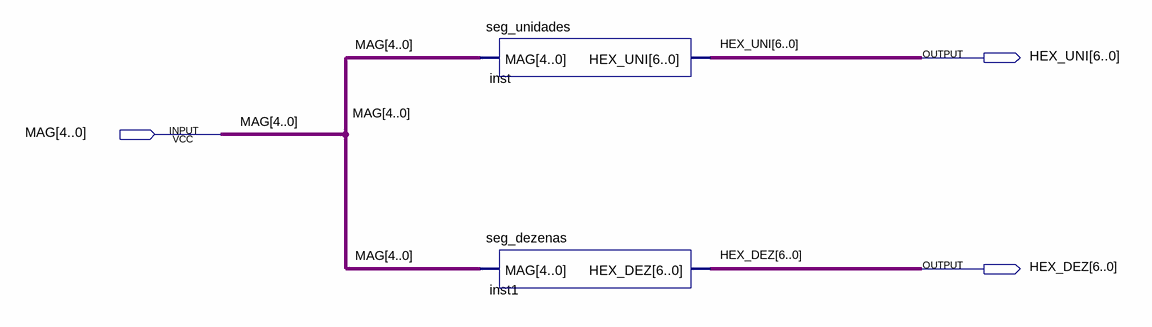
[diagram p0: schematic sheet]
// Quartus schematic decod_7seg_base.bdf as structural Verilog: 2 symbols, 3 pins
module decod_7seg_base (
  input  [4:0] MAG,
  output [6:0] HEX_UNI,
  output [6:0] HEX_DEZ
);

  seg_unidades inst (.MAG(MAG), .HEX_UNI(HEX_UNI));
  seg_dezenas inst1 (.MAG(MAG), .HEX_DEZ(HEX_DEZ));
endmodule
